# EAGLE schematic untitled (EAGLE 9.0.1)
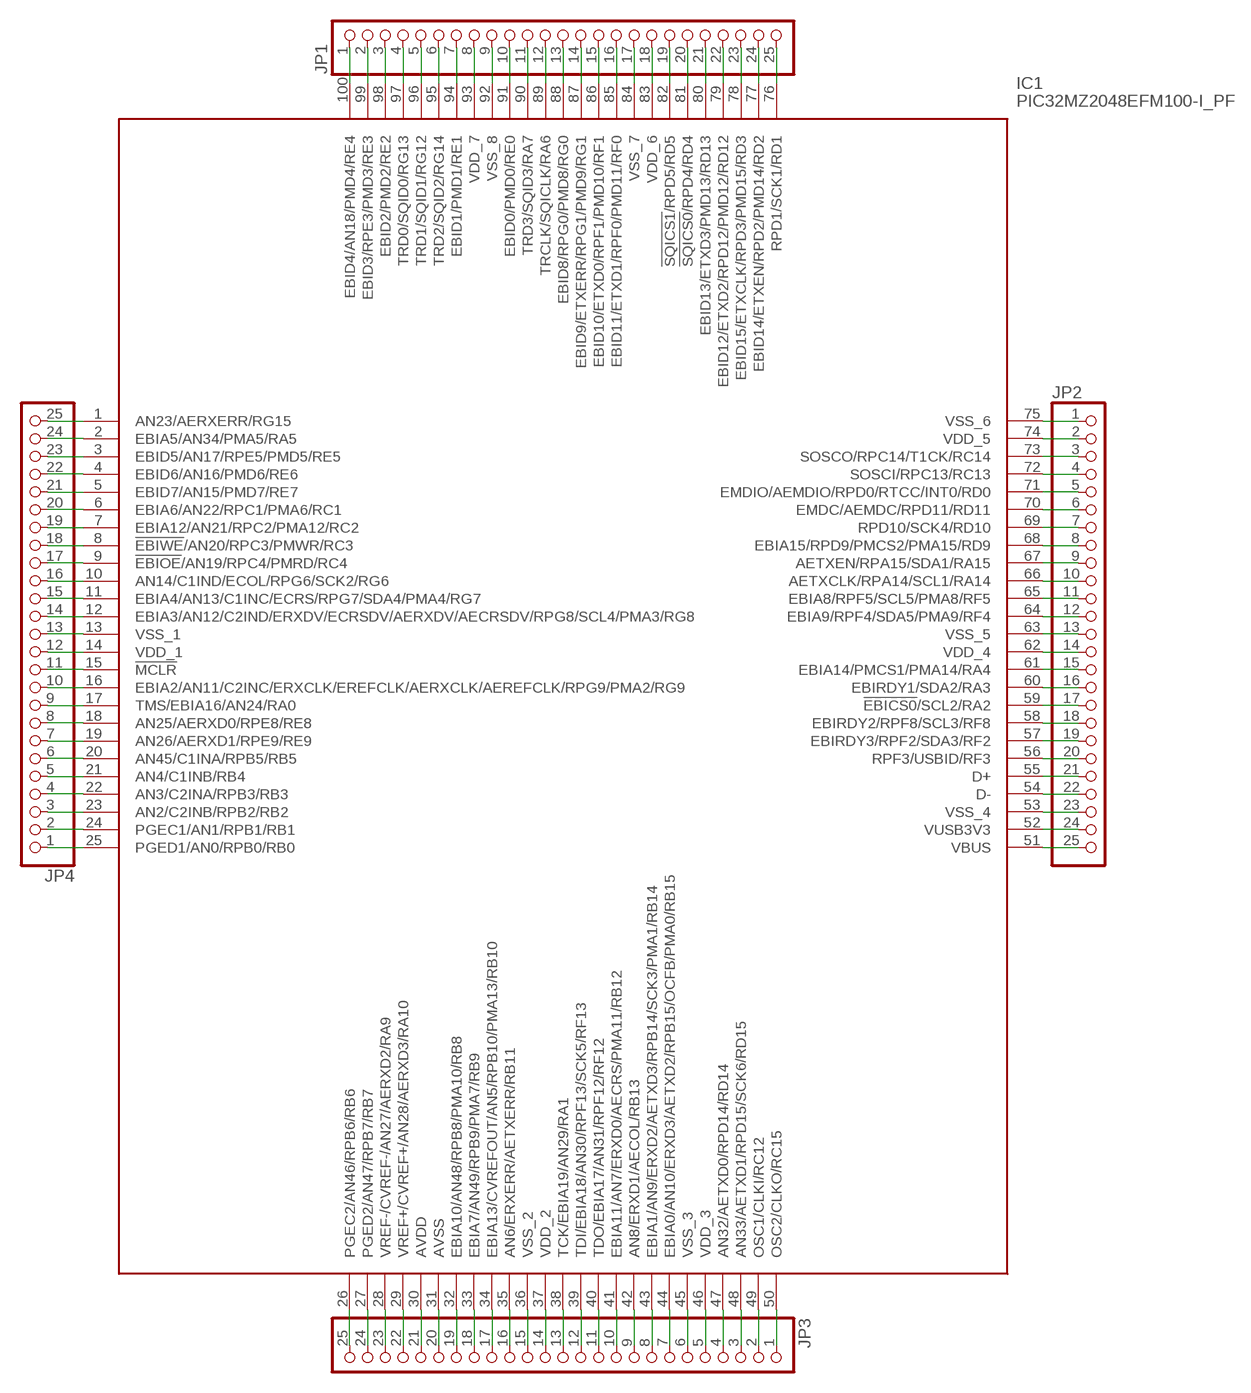
[diagram p0: schematic, sheet 1]

## Parts
IC1  PIC32MZ2048EFM100-I_PF  [QFP50P1600X1600X120-100N]
JP1  PINHD-1X25  [1X25]
JP2  PINHD-1X25  [1X25]
JP3  PINHD-1X25  [1X25]
JP4  PINHD-1X25  [1X25]

## Nets
N$1: IC1.100(EBID4/AN18/PMD4/RE4) JP1.1
N$2: IC1.99(EBID3/RPE3/PMD3/RE3) JP1.2
N$3: IC1.98(EBID2/PMD2/RE2) JP1.3
N$4: IC1.97(TRD0/SQID0/RG13) JP1.4
N$5: IC1.96(TRD1/SQID1/RG12) JP1.5
N$6: IC1.95(TRD2/SQID2/RG14) JP1.6
N$7: IC1.94(EBID1/PMD1/RE1) JP1.7
N$8: IC1.93(VDD_7) JP1.8
N$9: IC1.92(VSS_8) JP1.9
N$10: IC1.91(EBID0/PMD0/RE0) JP1.10
N$11: IC1.90(TRD3/SQID3/RA7) JP1.11
N$12: IC1.89(TRCLK/SQICLK/RA6) JP1.12
N$13: IC1.88(EBID8/RPG0/PMD8/RG0) JP1.13
N$14: IC1.87(EBID9/ETXERR/RPG1/PMD9/RG1) JP1.14
N$15: IC1.86(EBID10/ETXD0/RPF1/PMD10/RF1) JP1.15
N$16: IC1.85(EBID11/ETXD1/RPF0/PMD11/RF0) JP1.16
N$17: IC1.84(VSS_7) JP1.17
N$18: IC1.83(VDD_6) JP1.18
N$19: IC1.82(!SQICS1!/RPD5/RD5) JP1.19
N$20: IC1.81(!SQICS0!/RPD4/RD4) JP1.20
N$21: IC1.80(EBID13/ETXD3/PMD13/RD13) JP1.21
N$22: IC1.79(EBID12/ETXD2/RPD12/PMD12/RD12) JP1.22
N$23: IC1.78(EBID15/ETXCLK/RPD3/PMD15/RD3) JP1.23
N$24: IC1.77(EBID14/ETXEN/RPD2/PMD14/RD2) JP1.24
N$25: IC1.76(RPD1/SCK1/RD1) JP1.25
N$26: IC1.75(VSS_6) JP2.1
N$27: IC1.74(VDD_5) JP2.2
N$28: IC1.73(SOSCO/RPC14/T1CK/RC14) JP2.3
N$29: IC1.72(SOSCI/RPC13/RC13) JP2.4
N$30: IC1.71(EMDIO/AEMDIO/RPD0/RTCC/INT0/RD0) JP2.5
N$31: IC1.70(EMDC/AEMDC/RPD11/RD11) JP2.6
N$32: IC1.69(RPD10/SCK4/RD10) JP2.7
N$33: IC1.68(EBIA15/RPD9/PMCS2/PMA15/RD9) JP2.8
N$34: IC1.67(AETXEN/RPA15/SDA1/RA15) JP2.9
N$35: IC1.66(AETXCLK/RPA14/SCL1/RA14) JP2.10
N$36: IC1.65(EBIA8/RPF5/SCL5/PMA8/RF5) JP2.11
N$37: IC1.64(EBIA9/RPF4/SDA5/PMA9/RF4) JP2.12
N$38: IC1.63(VSS_5) JP2.13
N$39: IC1.62(VDD_4) JP2.14
N$40: IC1.61(EBIA14/PMCS1/PMA14/RA4) JP2.15
N$41: IC1.60(EBIRDY1/SDA2/RA3) JP2.16
N$42: IC1.59(!EBICS0!/SCL2/RA2) JP2.17
N$43: IC1.58(EBIRDY2/RPF8/SCL3/RF8) JP2.18
N$44: IC1.57(EBIRDY3/RPF2/SDA3/RF2) JP2.19
N$45: IC1.56(RPF3/USBID/RF3) JP2.20
N$46: IC1.55(D+) JP2.21
N$47: IC1.54(D-) JP2.22
N$48: IC1.53(VSS_4) JP2.23
N$49: IC1.52(VUSB3V3) JP2.24
N$50: IC1.51(VBUS) JP2.25
N$51: IC1.26(PGEC2/AN46/RPB6/RB6) JP3.25
N$52: IC1.27(PGED2/AN47/RPB7/RB7) JP3.24
N$53: IC1.28(VREF-/CVREF-/AN27/AERXD2/RA9) JP3.23
N$54: IC1.29(VREF+/CVREF+/AN28/AERXD3/RA10) JP3.22
N$55: IC1.30(AVDD) JP3.21
N$56: IC1.31(AVSS) JP3.20
N$57: IC1.32(EBIA10/AN48/RPB8/PMA10/RB8) JP3.19
N$58: IC1.33(EBIA7/AN49/RPB9/PMA7/RB9) JP3.18
N$59: IC1.34(EBIA13/CVREFOUT/AN5/RPB10/PMA13/RB10) JP3.17
N$60: IC1.35(AN6/ERXERR/AETXERR/RB11) JP3.16
N$61: IC1.36(VSS_2) JP3.15
N$62: IC1.37(VDD_2) JP3.14
N$63: IC1.38(TCK/EBIA19/AN29/RA1) JP3.13
N$64: IC1.39(TDI/EBIA18/AN30/RPF13/SCK5/RF13) JP3.12
N$65: IC1.40(TDO/EBIA17/AN31/RPF12/RF12) JP3.11
N$66: IC1.41(EBIA11/AN7/ERXD0/AECRS/PMA11/RB12) JP3.10
N$67: IC1.42(AN8/ERXD1/AECOL/RB13) JP3.9
N$68: IC1.43(EBIA1/AN9/ERXD2/AETXD3/RPB14/SCK3/PMA1/RB14) JP3.8
N$69: IC1.44(EBIA0/AN10/ERXD3/AETXD2/RPB15/OCFB/PMA0/RB15) JP3.7
N$70: IC1.45(VSS_3) JP3.6
N$71: IC1.46(VDD_3) JP3.5
N$72: IC1.47(AN32/AETXD0/RPD14/RD14) JP3.4
N$73: IC1.48(AN33/AETXD1/RPD15/SCK6/RD15) JP3.3
N$74: IC1.49(OSC1/CLKI/RC12) JP3.2
N$75: IC1.50(OSC2/CLKO/RC15) JP3.1
N$76: IC1.1(AN23/AERXERR/RG15) JP4.25
N$77: IC1.2(EBIA5/AN34/PMA5/RA5) JP4.24
N$78: IC1.3(EBID5/AN17/RPE5/PMD5/RE5) JP4.23
N$79: IC1.4(EBID6/AN16/PMD6/RE6) JP4.22
N$80: IC1.5(EBID7/AN15/PMD7/RE7) JP4.21
N$81: IC1.6(EBIA6/AN22/RPC1/PMA6/RC1) JP4.20
N$82: IC1.7(EBIA12/AN21/RPC2/PMA12/RC2) JP4.19
N$83: IC1.8(!EBIWE!/AN20/RPC3/PMWR/RC3) JP4.18
N$84: IC1.9(!EBIOE!/AN19/RPC4/PMRD/RC4) JP4.17
N$85: IC1.10(AN14/C1IND/ECOL/RPG6/SCK2/RG6) JP4.16
N$86: IC1.11(EBIA4/AN13/C1INC/ECRS/RPG7/SDA4/PMA4/RG7) JP4.15
N$87: IC1.12(EBIA3/AN12/C2IND/ERXDV/ECRSDV/AERXDV/AECRSDV/RPG8/SCL4/PMA3/RG8) JP4.14
N$88: IC1.13(VSS_1) JP4.13
N$89: IC1.14(VDD_1) JP4.12
N$90: IC1.15(!MCLR) JP4.11
N$91: IC1.16(EBIA2/AN11/C2INC/ERXCLK/EREFCLK/AERXCLK/AEREFCLK/RPG9/PMA2/RG9) JP4.10
N$92: IC1.17(TMS/EBIA16/AN24/RA0) JP4.9
N$93: IC1.18(AN25/AERXD0/RPE8/RE8) JP4.8
N$94: IC1.19(AN26/AERXD1/RPE9/RE9) JP4.7
N$95: IC1.20(AN45/C1INA/RPB5/RB5) JP4.6
N$96: IC1.21(AN4/C1INB/RB4) JP4.5
N$97: IC1.22(AN3/C2INA/RPB3/RB3) JP4.4
N$98: IC1.23(AN2/C2INB/RPB2/RB2) JP4.3
N$99: IC1.24(PGEC1/AN1/RPB1/RB1) JP4.2
N$100: IC1.25(PGED1/AN0/RPB0/RB0) JP4.1

## Library data of the parts
IC1 = PIC32MZ2048EFM100-I_PF:PIC32MZ2048EFM100-I_PF: MCU 32-bit 200MHz 2MB Prog 3.3V TQFP-100 Microchip PIC32MZ2048EFM100-I/PF, 32bit MIPS MicroAptiv Microcontroller, 200MHz, 160 (Boot Flash) kB, 2048 (Flash) kB Source: Datasheet <https://componentsearchengine.com/Datasheets/2/PIC32MZ2048EFM100-I_PF.pdf>; DESCRIPTION: MCU 32-bit 200MHz 2MB Prog 3.3V TQFP-100 Microchip PIC32MZ2048EFM100-I/PF, 32bit MIPS MicroAptiv Microcontroller, 200MHz, 160 (Boot Flash) kB, 2048 (Flash) kB; HEIGHT: 1.2mm; MANUFACTURER_NAME: Microchip; MANUFACTURER_PART_NUMBER: PIC32MZ2048EFM100-I/PF; MOUSER_PART_NUMBER: 579-MZ2048EFM100IPF; MOUSER_PRICE-STOCK: https://www.mouser.com/Search/Refine.aspx?Keyword=579-MZ2048EFM100IPF; RS_PART_NUMBER: 1654261; RS_PRICE-STOCK: http://uk.rs-online.com/web/p/products/1654261
JP1-JP4 = pinhead:PINHD-1X25: PIN HEADER